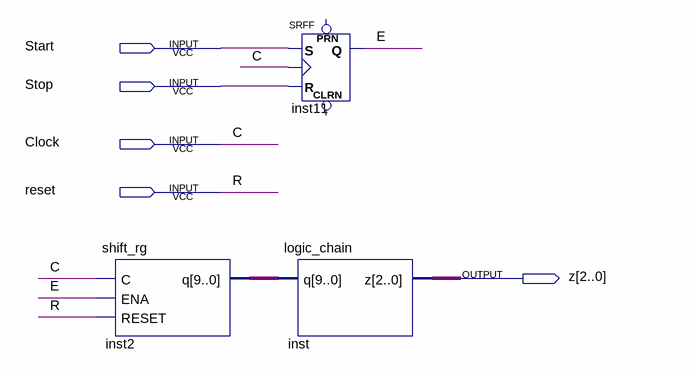
[diagram p0: schematic sheet]
// Quartus schematic scheme1.bdf as structural Verilog: 3 symbols, 5 pins
module scheme1 (
  input  Start,
  input  Stop,
  input  Clock,
  input  reset,
  output [2:0] z
);

  wire E;
  wire [9:0] inst2_q;

  shift_rg inst2 (.C(Clock), .ENA(E), .RESET(reset), .q(inst2_q));
  SRFF inst11 (.S(Start), .R(Stop), .CLK(Clock), .Q(E));  // open: PRN, CLRN
  logic_chain inst (.q(inst2_q), .z(z));

  // Other names for the same wires on the sheet: C = Clock; R = reset
endmodule
